# EAGLE design main_v2 (EAGLE 6.6.0)
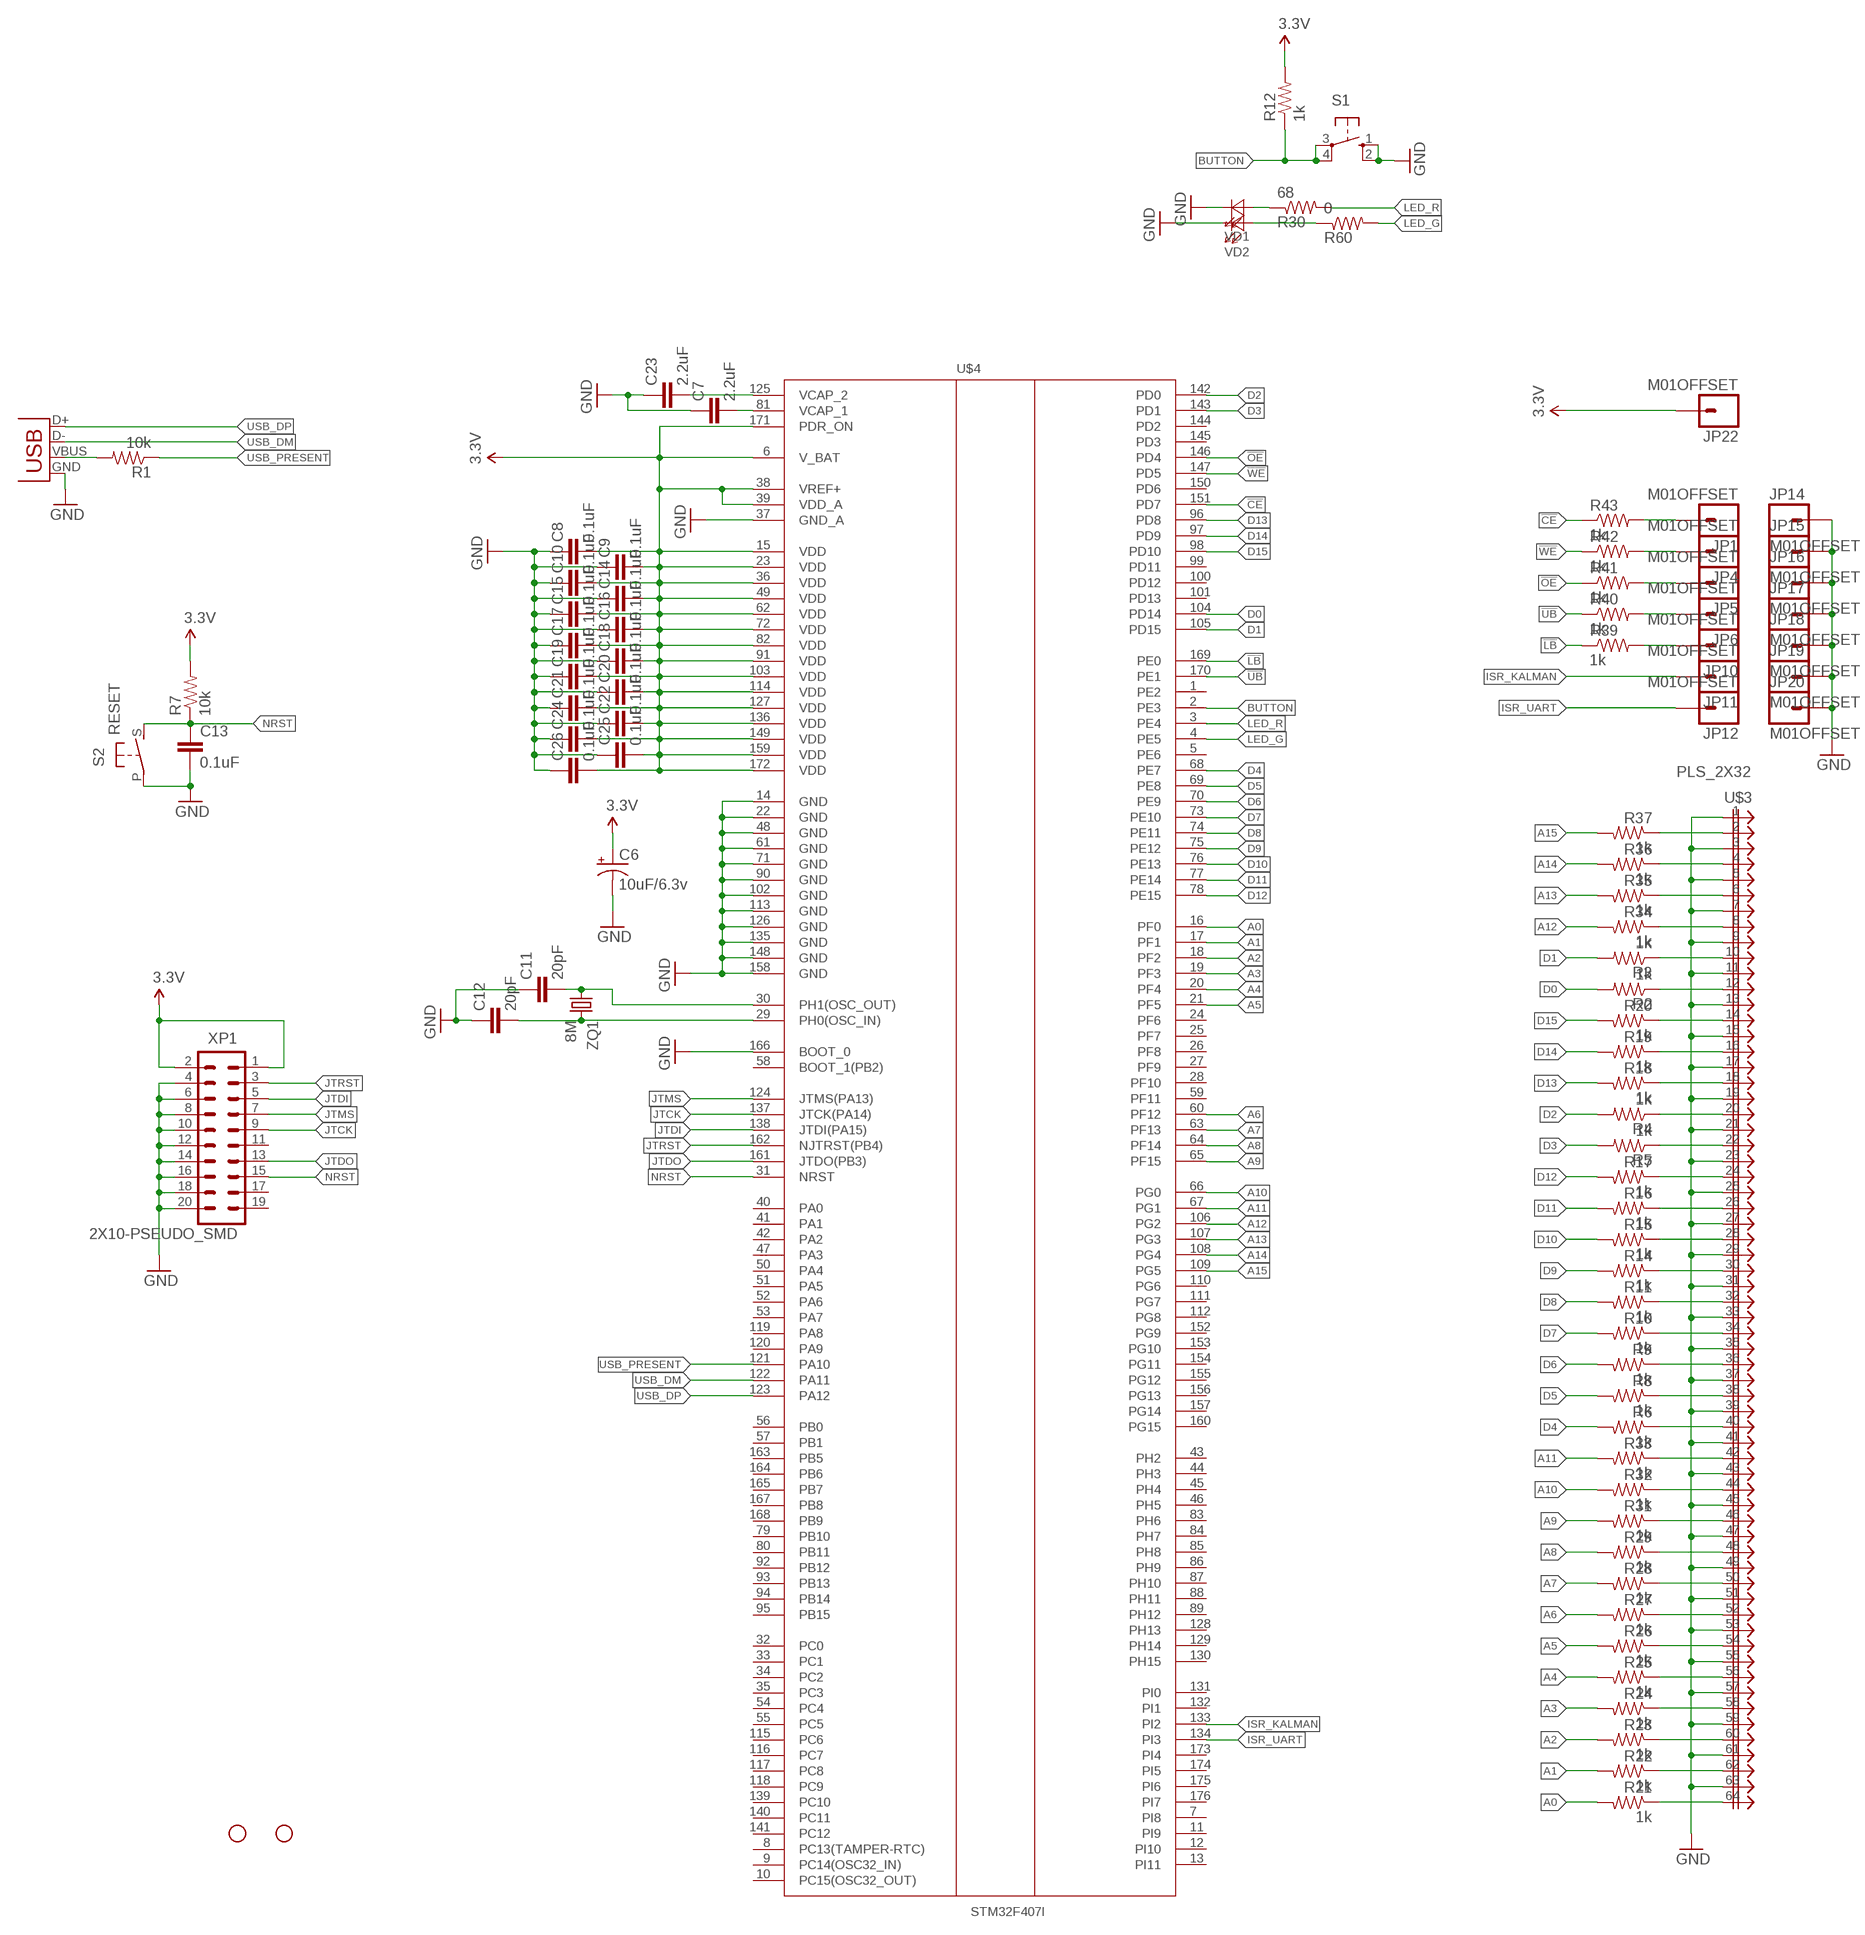
[diagram p0: schematic, sheet 1]

## Parts
C6  10uF/6.3v  CAP_POL1206-KIT  [EIA3216-KIT]
C7  2.2uF  CAP0805  [0805]
C8  0.1uF  CAP0805  [0805]
C9  0.1uF  CAP0805  [0805]
C10  0.1uF  CAP0805  [0805]
C11  20pF  CAP0805  [0805]
C12  20pF  CAP0805  [0805]
C13  0.1uF  CAP0805  [0805]
C14  0.1uF  CAP0805  [0805]
C15  0.1uF  CAP0805  [0805]
C16  0.1uF  CAP0805  [0805]
C17  0.1uF  CAP0805  [0805]
C18  0.1uF  CAP0805  [0805]
C19  0.1uF  CAP0805  [0805]
C20  0.1uF  CAP0805  [0805]
C21  0.1uF  CAP0805  [0805]
C22  0.1uF  CAP0805  [0805]
C23  2.2uF  CAP0805  [0805]
C24  0.1uF  CAP0805  [0805]
C25  0.1uF  CAP0805  [0805]
C26  0.1uF  CAP0805  [0805]
JP1  M01OFFSET  [1X01_OFFSET]
JP4  M01OFFSET  [1X01_OFFSET]
JP5  M01OFFSET  [1X01_OFFSET]
JP6  M01OFFSET  [1X01_OFFSET]
JP7  STAND-OFF  [STAND-OFF]
JP8  STAND-OFF  [STAND-OFF]
JP10  M01OFFSET  [1X01_OFFSET]
JP11  M01OFFSET  [1X01_OFFSET]
JP12  M01OFFSET  [1X01_OFFSET]
JP14  M01OFFSET  [1X01_OFFSET]
JP15  M01OFFSET  [1X01_OFFSET]
JP16  M01OFFSET  [1X01_OFFSET]
JP17  M01OFFSET  [1X01_OFFSET]
JP18  M01OFFSET  [1X01_OFFSET]
JP19  M01OFFSET  [1X01_OFFSET]
JP20  M01OFFSET  [1X01_OFFSET]
JP22  M01OFFSET  [1X01_OFFSET]
R1  10k  RESISTOR0805-RES  [0805]
R2  1k  RESISTOR0805-RES  [0805]
R3  1k  RESISTOR0805-RES  [0805]
R4  1k  RESISTOR0805-RES  [0805]
R5  1k  RESISTOR0805-RES  [0805]
R6  1k  RESISTOR0805-RES  [0805]
R7  10k  RESISTOR0805-RES  [0805]
R8  1k  RESISTOR0805-RES  [0805]
R9  1k  RESISTOR0805-RES  [0805]
R10  1k  RESISTOR0805-RES  [0805]
R11  1k  RESISTOR0805-RES  [0805]
R12  1k  RESISTOR0805-RES  [0805]
R14  1k  RESISTOR0805-RES  [0805]
R15  1k  RESISTOR0805-RES  [0805]
R16  1k  RESISTOR0805-RES  [0805]
R17  1k  RESISTOR0805-RES  [0805]
R18  1k  RESISTOR0805-RES  [0805]
R19  1k  RESISTOR0805-RES  [0805]
R20  1k  RESISTOR0805-RES  [0805]
R21  1k  RESISTOR0805-RES  [0805]
R22  1k  RESISTOR0805-RES  [0805]
R23  1k  RESISTOR0805-RES  [0805]
R24  1k  RESISTOR0805-RES  [0805]
R25  1k  RESISTOR0805-RES  [0805]
R26  1k  RESISTOR0805-RES  [0805]
R27  1k  RESISTOR0805-RES  [0805]
R28  1k  RESISTOR0805-RES  [0805]
R29  1k  RESISTOR0805-RES  [0805]
R30  68  RESISTOR0805-RES  [0805]
R31  1k  RESISTOR0805-RES  [0805]
R32  1k  RESISTOR0805-RES  [0805]
R33  1k  RESISTOR0805-RES  [0805]
R34  1k  RESISTOR0805-RES  [0805]
R35  1k  RESISTOR0805-RES  [0805]
R36  1k  RESISTOR0805-RES  [0805]
R37  1k  RESISTOR0805-RES  [0805]
R39  1k  RESISTOR0805-RES  [0805]
R40  1k  RESISTOR0805-RES  [0805]
R41  1k  RESISTOR0805-RES  [0805]
R42  1k  RESISTOR0805-RES  [0805]
R43  1k  RESISTOR0805-RES  [0805]
R60  0  RESISTOR0805-RES  [0805]
S1  10-XX  [B3F-10XX]
S2  RESET  BUTTON_6X3.5  [BUTTON_6X3.5]
U$3  PLS_2X32  [PLS_2X32_PSEUDOSMD]
U$4  STM32F407I  [TQFP176(1.5X0.25)]
VD1  LED1206  [LED-1206]
VD2  LED1206  [LED-1206]
X1  USB-SMD-NS  [USB-MINIB-NOSTOP]
XP1  2X10-PSEUDO_SMD  [PLD_2X10_PSEUDOSMD]
ZQ1  8M  CRYSTALCTS406  [CTS406]

## Nets
3.3V: C6.A(+) C8.2 C9.2 C10.2 C14.2 C15.2 C16.2 C17.2 C18.2 C19.2 C20.2 C21.2 C22.2 C24.2 C25.2 C26.2 JP22.1 R7.2 R12.2 U$4.6(V_BAT) U$4.15(VDD) U$4.23(VDD) U$4.36(VDD) U$4.38(VREF+) U$4.39(VDD_A) U$4.49(VDD) U$4.62(VDD) U$4.72(VDD) U$4.82(VDD) U$4.91(VDD) U$4.103(VDD) U$4.114(VDD) U$4.127(VDD) U$4.136(VDD) U$4.149(VDD) U$4.159(VDD) U$4.171(PDR_ON) U$4.172(VDD) XP1.1 XP1.2
5V_USB: R1.2 X1.VBUS
!CE: R43.1 U$4.151(PD7)
!LB: R39.1 U$4.169(PE0)
!OE: R41.1 U$4.146(PD4)
!UB: R40.1 U$4.170(PE1)
!WE: R42.1 U$4.147(PD5)
A0: R21.2 U$4.16(PF0)
A1: R22.2 U$4.17(PF1)
A2: R23.2 U$4.18(PF2)
A3: R24.2 U$4.19(PF3)
A4: R25.2 U$4.20(PF4)
A5: R26.2 U$4.21(PF5)
A6: R27.2 U$4.60(PF12)
A7: R28.2 U$4.63(PF13)
A8: R29.2 U$4.64(PF14)
A9: R31.2 U$4.65(PF15)
A10: R32.2 U$4.66(PG0)
A11: R33.2 U$4.67(PG1)
A12: R34.2 U$4.106(PG2)
A13: R35.2 U$4.107(PG3)
A14: R36.2 U$4.108(PG4)
A15: R37.2 U$4.109(PG5)
BUTTON: R12.1 S1.3(P) S1.4(P1) U$4.2(PE3)
D0: R2.2 U$4.104(PD14)
D1: R3.2 U$4.105(PD15)
D2: R4.2 U$4.142(PD0)
D3: R5.2 U$4.143(PD1)
D4: R6.2 U$4.68(PE7)
D5: R8.2 U$4.69(PE8)
D6: R9.2 U$4.70(PE9)
D7: R10.2 U$4.73(PE10)
D8: R11.2 U$4.74(PE11)
D9: R14.2 U$4.75(PE12)
D10: R15.2 U$4.76(PE13)
D11: R16.2 U$4.77(PE14)
D12: R17.2 U$4.78(PE15)
D13: R18.2 U$4.96(PD8)
D14: R19.2 U$4.97(PD9)
D15: R20.2 U$4.98(PD10)
GND: C6.C(-) C7.1 C8.1 C9.1 C10.1 C11.1 C12.1 C13.2 C14.1 C15.1 C16.1 C17.1 C18.1 C19.1 C20.1 C21.1 C22.1 C23.1 C24.1 C25.1 C26.1 JP14.1 JP15.1 JP16.1 JP17.1 JP18.1 JP19.1 JP20.1 S1.1(S) S1.2(S1) S2.P U$3.1 U$3.3 U$3.5 U$3.7 U$3.9 U$3.11 U$3.13 U$3.15 U$3.17 U$3.19 U$3.21 U$3.23 U$3.25 U$3.27 U$3.29 U$3.31 U$3.33 U$3.35 U$3.37 U$3.39 U$3.41 U$3.43 U$3.45 U$3.47 U$3.49 U$3.51 U$3.53 U$3.55 U$3.57 U$3.59 U$3.61 U$3.63 U$4.14(GND) U$4.22(GND) U$4.37(GND_A) U$4.48(GND) U$4.61(GND) U$4.71(GND) U$4.90(GND) U$4.102(GND) U$4.113(GND) U$4.126(GND) U$4.135(GND) U$4.148(GND) U$4.158(GND) U$4.166(BOOT_0) VD1.C VD2.C X1.GND XP1.4 XP1.6 XP1.8 XP1.10 XP1.12 XP1.14 XP1.16 XP1.18 XP1.20
ISR_KALMAN: JP11.1 U$4.133(PI2)
ISR_UART: JP12.1 U$4.134(PI3)
JTCK: U$4.137(JTCK(PA14)) XP1.9
JTDI: U$4.138(JTDI(PA15)) XP1.5
JTDO: U$4.161(JTDO(PB3)) XP1.13
JTMS: U$4.124(JTMS(PA13)) XP1.7
JTRST: U$4.162(NJTRST(PB4)) XP1.3
LED_G: R60.2 U$4.4(PE5)
LED_R: R30.2 U$4.3(PE4)
N$1: C23.2 U$4.125(VCAP_2)
N$2: C7.2 U$4.81(VCAP_1)
N$3: JP1.1 R43.2
N$4: R5.1 U$3.22
N$5: R4.1 U$3.20
N$6: R18.1 U$3.18
N$7: R19.1 U$3.16
N$8: R6.1 U$3.40
N$9: R8.1 U$3.38
N$10: R21.1 U$3.64
N$11: R9.1 U$3.36
N$12: R30.1 VD1.A
N$13: R22.1 U$3.62
N$14: R10.1 U$3.34
N$15: R11.1 U$3.32
N$16: R14.1 U$3.30
N$17: R15.1 U$3.28
N$18: R16.1 U$3.26
N$19: R17.1 U$3.24
N$20: R20.1 U$3.14
N$21: C12.2 U$4.29(PH0(OSC_IN)) ZQ1.3
N$22: C11.2 U$4.30(PH1(OSC_OUT)) ZQ1.1
N$23: R2.1 U$3.12
N$24: R3.1 U$3.10
N$25: R23.1 U$3.60
N$26: R24.1 U$3.58
N$27: R25.1 U$3.56
N$28: R26.1 U$3.54
N$29: R27.1 U$3.52
N$30: R28.1 U$3.50
N$31: R60.1 VD2.A
N$32: R29.1 U$3.48
N$33: R31.1 U$3.46
N$34: R32.1 U$3.44
N$35: R33.1 U$3.42
N$36: R34.1 U$3.8
N$37: R35.1 U$3.6
N$38: R36.1 U$3.4
N$39: R37.1 U$3.2
N$42: JP4.1 R42.2
N$43: JP5.1 R41.2
N$44: JP6.1 R40.2
N$45: JP10.1 R39.2
NRST: C13.1 R7.1 S2.S U$4.31(NRST) XP1.15
USB_DM: U$4.122(PA11) X1.D-
USB_DP: U$4.123(PA12) X1.D+
USB_PRESENT: R1.1 U$4.121(PA10)
Unconnected: U$4.1(PE2) U$4.5(PE6) U$4.7(PI8) U$4.8(PC13(TAMPER-RTC)) U$4.9(PC14(OSC32_IN)) U$4.10(PC15(OSC32_OUT)) U$4.11(PI9) U$4.12(PI10) U$4.13(PI11) U$4.24(PF6) U$4.25(PF7) U$4.26(PF8) U$4.27(PF9) U$4.28(PF10) U$4.32(PC0) U$4.33(PC1) U$4.34(PC2) U$4.35(PC3) U$4.40(PA0) U$4.41(PA1) U$4.42(PA2) U$4.43(PH2) U$4.44(PH3) U$4.45(PH4) U$4.46(PH5) U$4.47(PA3) U$4.50(PA4) U$4.51(PA5) U$4.52(PA6) U$4.53(PA7) U$4.54(PC4) U$4.55(PC5) U$4.56(PB0) U$4.57(PB1) U$4.58(BOOT_1(PB2)) U$4.59(PF11) U$4.79(PB10) U$4.80(PB11) U$4.83(PH6) U$4.84(PH7) U$4.85(PH8) U$4.86(PH9) U$4.87(PH10) U$4.88(PH11) U$4.89(PH12) U$4.92(PB12) U$4.93(PB13) U$4.94(PB14) U$4.95(PB15) U$4.99(PD11) U$4.100(PD12) U$4.101(PD13) U$4.110(PG6) U$4.111(PG7) U$4.112(PG8) U$4.115(PC6) U$4.116(PC7) U$4.117(PC8) U$4.118(PC9) U$4.119(PA8) U$4.120(PA9) U$4.128(PH13) U$4.129(PH14) U$4.130(PH15) U$4.131(PI0) U$4.132(PI1) U$4.139(PC10) U$4.140(PC11) U$4.141(PC12) U$4.144(PD2) U$4.145(PD3) U$4.150(PD6) U$4.152(PG9) U$4.153(PG10) U$4.154(PG11) U$4.155(PG12) U$4.156(PG13) U$4.157(PG14) U$4.160(PG15) U$4.163(PB5) U$4.164(PB6) U$4.165(PB7) U$4.167(PB8) U$4.168(PB9) U$4.173(PI4) U$4.174(PI5) U$4.175(PI6) U$4.176(PI7) XP1.11 XP1.17 XP1.19

## Library data of the parts
C6 = SparkFun:CAP_POL: Capacitor Polarized These are standard SMD and PTH capacitors. Normally 10uF, 47uF, and 100uF in electrolytic and tantalum varieties. Always verify the external diameter of the through hole cap, it varies with capacity, voltage, and manufacturer. The EIA devices should be standard.
C7-C26 = SparkFun:CAP: Capacitor Standard 0603 ceramic capacitor, and 0.1" leaded capacitor.
JP1 JP4-JP6 JP10-JP12 JP14-JP20 JP22 = SparkFun-Connectors:M01: Header 1 Standard 1-pin 0.1" header. Use with straight break away headers (SKU : PRT-00116), right angle break away headers (PRT-00553), swiss pins (PRT-00743), machine pins (PRT-00117), and female headers (PRT-00115).
JP7 JP8 = barthess:STAND-OFF: Stand Off This is the mechanical footprint for a #4 phillips button head screw. Use the keepout ring to avoid running the screw head into surrounding components. SKU : PRT-00447
R1-R12 R14-R37 R39-R43 R60 = SparkFun:RESISTOR: Resistor Basic schematic elements and footprints for 0603, 1206, and PTH resistors.
S1 = switch-omron:10-XX: OMRON SWITCH; MPN: B3F-1000; OC_FARNELL: 176432; OC_NEWARK: 36M3542
S2 = barthess:BUTTON_6X3.5: OMRON SWITCH
U$3 = barthess:PLS_2X32
U$4 = barthess:STM32F407I
VD1 VD2 = led:LED: LEDs SMD Leds
X1 = SparkFun:USB: USB Connectors USB-B-PTH is fully proven SKU : PRT-00139 USB-miniB is fully proven SKU : PRT-00587 USB-A-PCB is untested. USB-A-H is throughly reviewed, but untested. Spark Fun Electronics SKU : PRT-00437 USB-B-SMT is throughly reviewed, but untested. Needs silkscreen touching up. USB-A-S has not been used/tested USB-MB-H has not been used/tested
XP1 = barthess:2X10: Standard 10x2 JTAG header for ARM.
ZQ1 = crystal:CRYSTAL: CRYSTAL; OC_FARNELL: unknown; OC_NEWARK: unknown

## Net classes
1 +5V_A: width 0.4 mm, drill 0.5 mm
2 +3.3V_A: width 0.4 mm, drill 0.5 mm
3 GND_A: width 0.4 mm, drill 0.5 mm

## Board
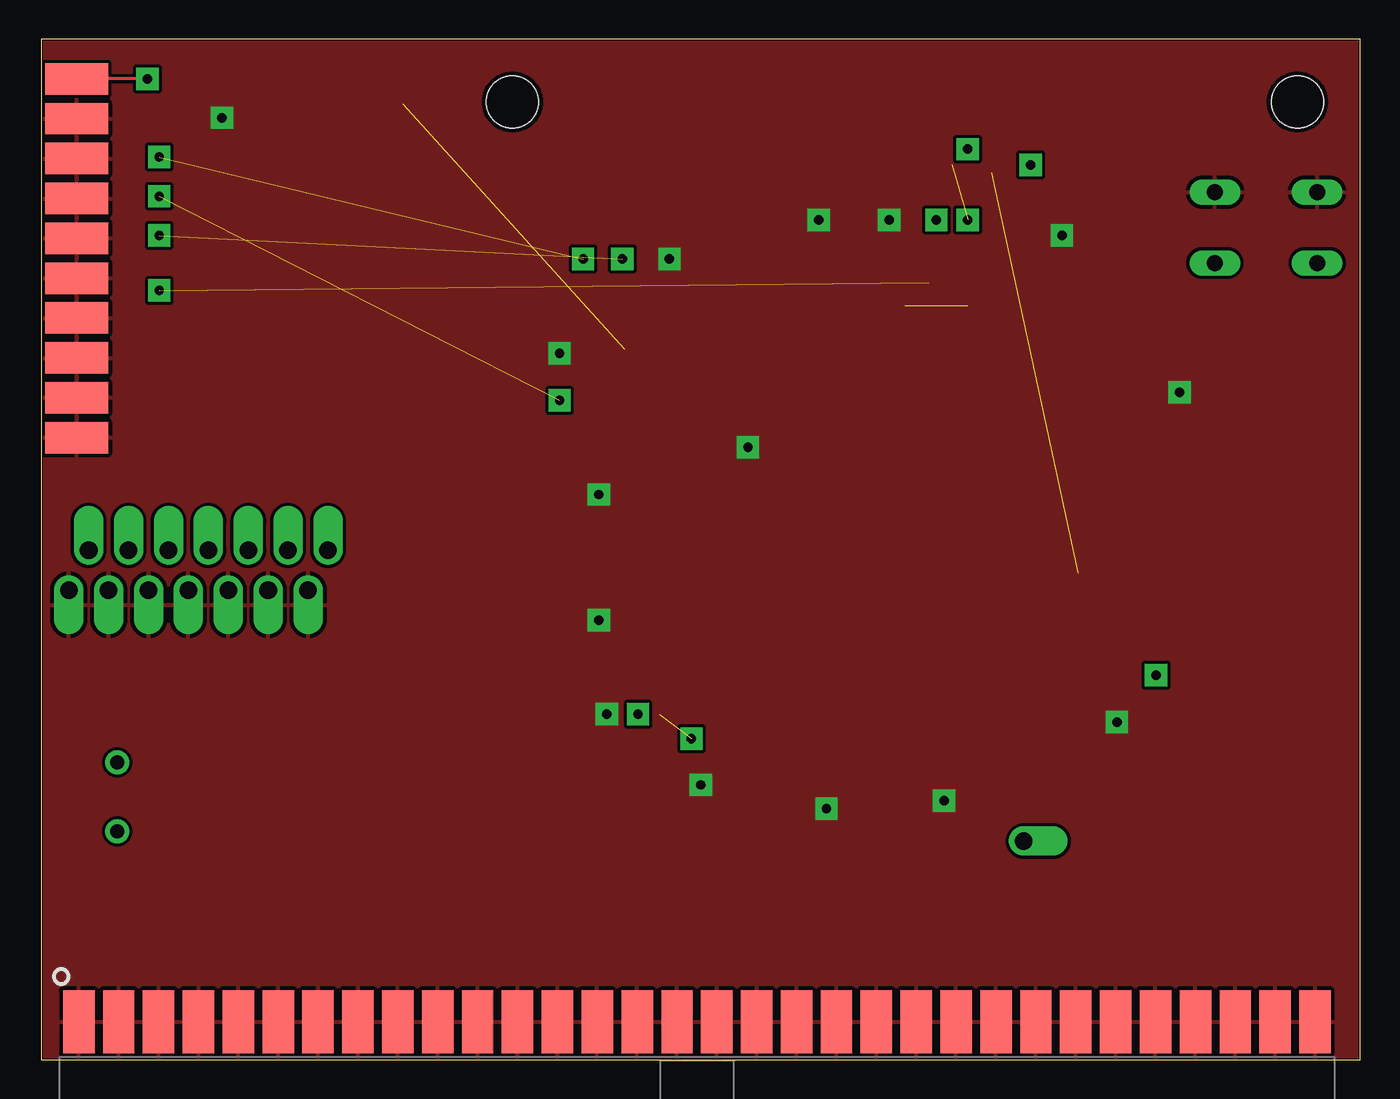
[diagram p1: board, top side]
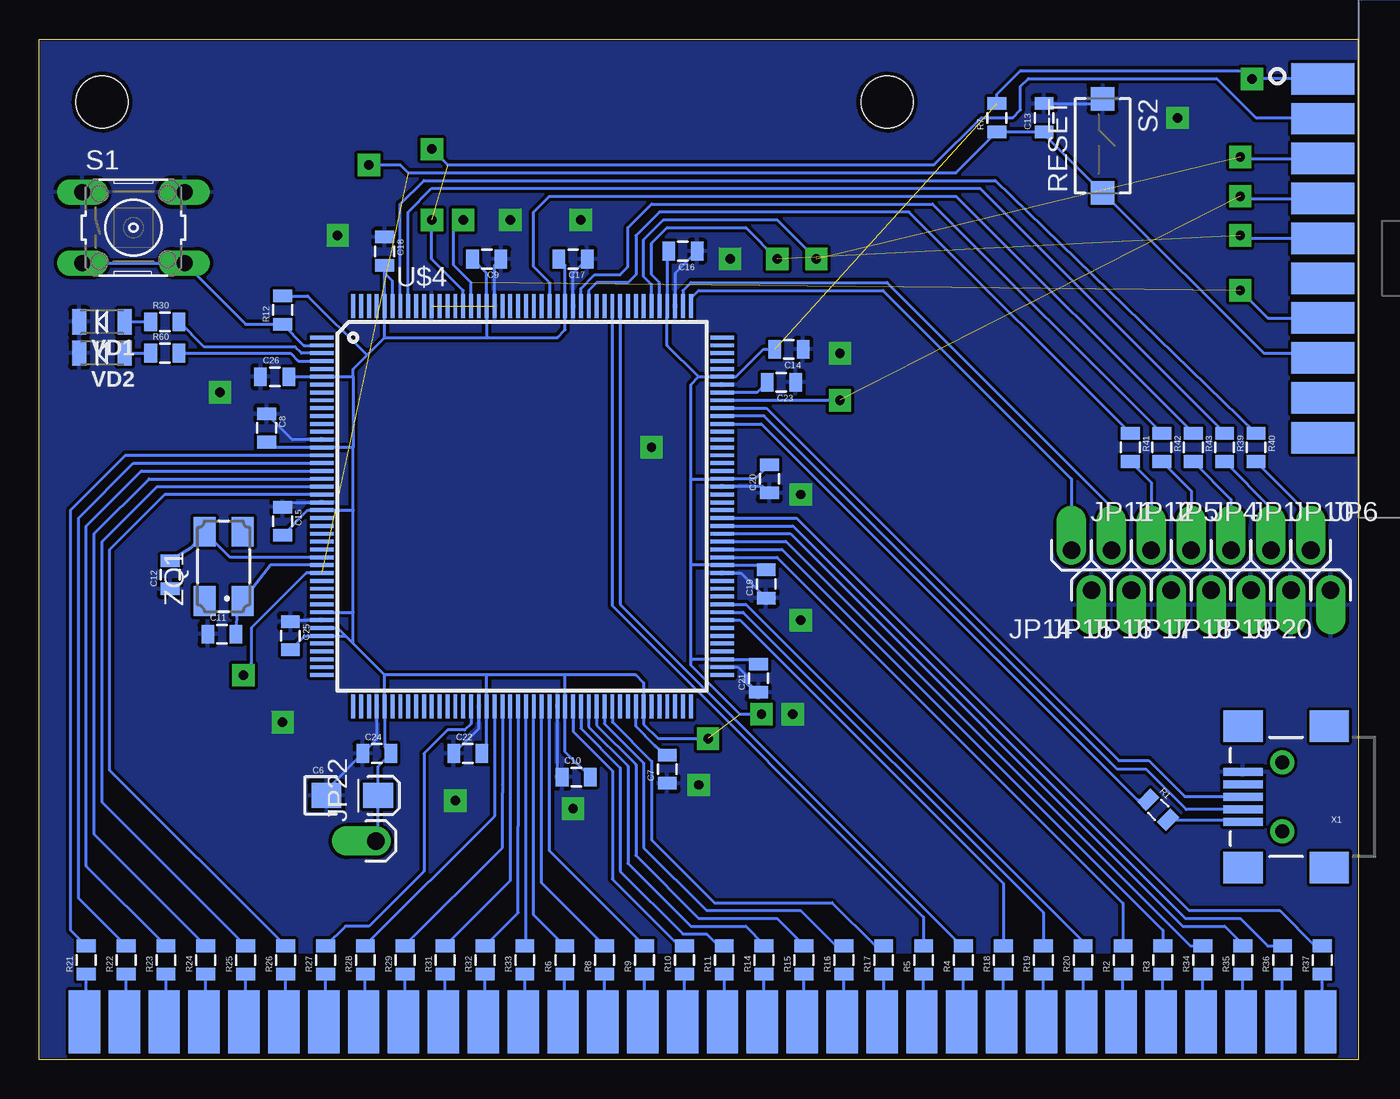
[diagram p2: board, bottom side, seen from below]

Size 84 x 65 mm. Coordinates in mm from the lower left corner, seen from the top.
Outline: 0,0 84,0 84,65 0,65 0,0
Copper layers (1*16): Top 0.035mm / dielectric 1.5mm / Bottom 0.035mm
Design rules "lut": minimum track width 0.0051mm, minimum drill 0.3mm, track to track 0.2mm, track to pad 0.25mm, pad to pad 0.15mm, via to via 0.15mm, smd to smd 0.15mm, copper to edge 0.1mm, drill to drill 40mil, minimum pad ring 12mil, minimum via ring 12mil, stop-mask expansion 4mil, vias tented up to drill 0mil, thermal gap 10mil
bRestrict: area 1.5,6 to 81.8,6.8

### Footprints (pad centres in the part's own frame; a part is rotated, then mirrored left to right if it is on the bottom)
EIA3216-KIT = smd 1.9 x 1.6: A 1.65,0; C -1.65,0
0805 = smd 0.8 x 1.2: 1 -0.9,0; 2 0.9,0
1X01_OFFSET = drill 1.118 pad 1.88 offset: 1 0,0
STAND-OFF = hole 3.3: 0,0
B3F-10XX = drill 1.016 long: 1 -3.251,2.261; 2 3.251,2.261; 3 -3.251,-2.261; 4 3.251,-2.261
BUTTON_6X3.5 = smd 1.5 x 1.5: P 0,-1.75; S 6,-1.75
PLS_2X32_PSEUDOSMD = smd 4 x 2: 1 -3.81,-39.37; 3 -3.81,-36.83; 5 -3.81,-34.29; 7 -3.81,-31.75; 9 -3.81,-29.21; 11 -3.81,-26.67; 13 -3.81,-24.13; 15 -3.81,-21.59; 17 -3.81,-19.05; 19 -3.81,-16.51; 21 -3.81,-13.97; 23 -3.81,-11.43; 25 -3.81,-8.89; 27 -3.81,-6.35; 29 -3.81,-3.81; 31 -3.81,-1.27; 33 -3.81,1.27; 35 -3.81,3.81; 37 -3.81,6.35; 39 -3.81,8.89; 41 -3.81,11.43; 43 -3.81,13.97; 45 -3.81,16.51; 47 -3.81,19.05; 49 -3.81,21.59; 51 -3.81,24.13; 53 -3.81,26.67; 55 -3.81,29.21; 57 -3.81,31.75; 59 -3.81,34.29; 61 -3.81,36.83; 63 -3.81,39.37 | smd 4 x 2 bottom: 2 -3.81,-39.37; 4 -3.81,-36.83; 6 -3.81,-34.29; 8 -3.81,-31.75; 10 -3.81,-29.21; 12 -3.81,-26.67; 14 -3.81,-24.13; 16 -3.81,-21.59; 18 -3.81,-19.05; 20 -3.81,-16.51; 22 -3.81,-13.97; 24 -3.81,-11.43; 26 -3.81,-8.89; 28 -3.81,-6.35; 30 -3.81,-3.81; 32 -3.81,-1.27; 34 -3.81,1.27; 36 -3.81,3.81; 38 -3.81,6.35; 40 -3.81,8.89; 42 -3.81,11.43; 44 -3.81,13.97; 46 -3.81,16.51; 48 -3.81,19.05; 50 -3.81,21.59; 52 -3.81,24.13; 54 -3.81,26.67; 56 -3.81,29.21; 58 -3.81,31.75; 60 -3.81,34.29; 62 -3.81,36.83; 64 -3.81,39.37
TQFP176(1.5X0.25) = smd 1.5 x 0.25: 1 -12,10; 2 -12,9.5; 3 -12,9; 4 -12,8.5; 5 -12,8; 6 -12,7.5; 7 -12,7; 8 -12,6.5; 9 -12,6; 10 -12,5.5; 11 -12,5; 12 -12,4.5; 13 -12,4; 14 -12,3.5; 15 -12,3; 16 -12,2.5; 17 -12,2; 18 -12,1.5; 19 -12,1; 20 -12,0.5; 21 -12,0; 22 -12,-0.5; 23 -12,-1; 24 -12,-1.5; 25 -12,-2; 26 -12,-2.5; 27 -12,-3; 28 -12,-3.5; 29 -12,-4; 30 -12,-4.5; 31 -12,-5; 32 -12,-5.5; 33 -12,-6; 34 -12,-6.5; 35 -12,-7; 36 -12,-7.5; 37 -12,-8; 38 -12,-8.5; 39 -12,-9; 40 -12,-9.5; 41 -12,-10; 42 -12,-10.5; 43 -12,-11; 44 -12,-11.5; 89 13.5,-11.5; 90 13.5,-11; 91 13.5,-10.5; 92 13.5,-10; 93 13.5,-9.5; 94 13.5,-9; 95 13.5,-8.5; 96 13.5,-8; 97 13.5,-7.5; 98 13.5,-7; 99 13.5,-6.5; 100 13.5,-6; 101 13.5,-5.5; 102 13.5,-5; 103 13.5,-4.5; 104 13.5,-4; 105 13.5,-3.5; 106 13.5,-3; 107 13.5,-2.5; 108 13.5,-2; 109 13.5,-1.5; 110 13.5,-1; 111 13.5,-0.5; 112 13.5,0; 113 13.5,0.5; 114 13.5,1; 115 13.5,1.5; 116 13.5,2; 117 13.5,2.5; 118 13.5,3; 119 13.5,3.5; 120 13.5,4; 121 13.5,4.5; 122 13.5,5; 123 13.5,5.5; 124 13.5,6; 125 13.5,6.5; 126 13.5,7; 127 13.5,7.5; 128 13.5,8; 129 13.5,8.5; 130 13.5,9; 131 13.5,9.5; 132 13.5,10 | smd 0.25 x 1.5: 45 -10,-13.5; 46 -9.5,-13.5; 47 -9,-13.5; 48 -8.5,-13.5; 49 -8,-13.5; 50 -7.5,-13.5; 51 -7,-13.5; 52 -6.5,-13.5; 53 -6,-13.5; 54 -5.5,-13.5; 55 -5,-13.5; 56 -4.5,-13.5; 57 -4,-13.5; 58 -3.5,-13.5; 59 -3,-13.5; 60 -2.5,-13.5; 61 -2,-13.5; 62 -1.5,-13.5; 63 -1,-13.5; 64 -0.5,-13.5; 65 0,-13.5; 66 0.5,-13.5; 67 1,-13.5; 68 1.5,-13.5; 69 2,-13.5; 70 2.5,-13.5; 71 3,-13.5; 72 3.5,-13.5; 73 4,-13.5; 74 4.5,-13.5; 75 5,-13.5; 76 5.5,-13.5; 77 6,-13.5; 78 6.5,-13.5; 79 7,-13.5; 80 7.5,-13.5; 81 8,-13.5; 82 8.5,-13.5; 83 9,-13.5; 84 9.5,-13.5; 85 10,-13.5; 86 10.5,-13.5; 87 11,-13.5; 88 11.5,-13.5; 133 11.5,12; 134 11,12; 135 10.5,12; 136 10,12; 137 9.5,12; 138 9,12; 139 8.5,12; 140 8,12; 141 7.5,12; 142 7,12; 143 6.5,12; 144 6,12; 145 5.5,12; 146 5,12; 147 4.5,12; 148 4,12; 149 3.5,12; 150 3,12; 151 2.5,12; 152 2,12; 153 1.5,12; 154 1,12; 155 0.5,12; 156 0,12; 157 -0.5,12; 158 -1,12; 159 -1.5,12; 160 -2,12; 161 -2.5,12; 162 -3,12; 163 -3.5,12; 164 -4,12; 165 -4.5,12; 166 -5,12; 167 -5.5,12; 168 -6,12; 169 -6.5,12; 170 -7,12; 171 -7.5,12; 172 -8,12; 173 -8.5,12; 174 -9,12; 175 -9.5,12; 176 -10,12
LED-1206 = smd 0.9 x 1.6: A -1.45,0; C 1.45,0
USB-MINIB-NOSTOP = smd 2.5 x 0.5: D+ 2.5,0; D- 2.5,0.8; GND 2.5,-1.6; ID 2.5,-0.8; VBUS 2.5,1.6 | smd 2.5 x 2: G1 -3,-4.5; G2 -3,4.5; G3 2.5,4.5; G4 2.5,-4.5 | drill 0.9 pad 0.8: H1 0,2.2 | drill 0.9 pad 0.787: H2 0,-2.2
PLD_2X10_PSEUDOSMD = smd 4 x 2: 1 0,11.43; 3 0,8.89; 5 0,6.35; 7 0,3.81; 9 0,1.27; 11 0,-1.27; 13 0,-3.81; 15 0,-6.35; 17 0,-8.89; 19 0,-11.43 | smd 4 x 2 bottom: 2 0,11.43; 4 0,8.89; 6 0,6.35; 8 0,3.81; 10 0,1.27; 12 0,-1.27; 14 0,-3.81; 16 0,-6.35; 18 0,-8.89; 20 0,-11.43
CTS406 = smd 1.9 x 1.4: 1 -2.2,-1.2; 2 2.2,-1.2; 3 2.2,1.2; 4 -2.2,1.2

### Placement (x,y rotation side)
C6  64.06,16.83 0 bottom
C7  44,18.5 90 bottom
C8  69.52,40.24 270 bottom
C9  55.5,51 180 bottom
C10  49.8,18 0 bottom
C11  72.36,27.11 0 bottom
C12  75.66,30.89 90 bottom
C13  20,60 90 bottom
C14  36.25,45.25 180 bottom
C15  68.5,34.3 270 bottom
C16  43,51.5 180 bottom
C17  50,51 180 bottom
C18  62,51.5 270 bottom
C19  37.7,30.3 90 bottom
C20  37.5,37 90 bottom
C21  38.2,24.3 90 bottom
C22  56.7,19.5 0 bottom
C23  36.73,43.15 180 bottom
C24  62.5,19.5 0 bottom
C25  68,27 270 bottom
C26  69,43.5 0 bottom
JP1  8.09,32.45 0 bottom
JP4  10.63,32.45 0 bottom
JP5  13.17,32.45 0 bottom
JP6  3.01,32.45 0 bottom
JP7  30,61 0 top
JP8  80,61 0 top
JP10  5.55,32.45 0 bottom
JP11  18.25,32.45 0 bottom
JP12  15.71,32.45 0 bottom
JP14  16.98,29.91 180 bottom
JP15  14.44,29.91 180 bottom
JP16  11.9,29.91 180 bottom
JP17  9.36,29.91 180 bottom
JP18  6.82,29.91 180 bottom
JP19  4.28,29.91 180 bottom
JP20  1.74,29.91 180 bottom
JP22  62.55,13.93 90 bottom
R1  12.73,15.92 315 bottom
R2  14.97,6.35 90 bottom
R3  12.43,6.35 90 bottom
R4  25.13,6.35 90 bottom
R5  27.67,6.35 90 bottom
R6  50.53,6.35 90 bottom
R7  23,60 90 bottom
R8  47.99,6.35 90 bottom
R9  45.45,6.35 90 bottom
R10  42.91,6.35 90 bottom
R11  40.37,6.35 90 bottom
R12  68.5,47.75 90 bottom
R14  37.83,6.35 90 bottom
R15  35.29,6.35 90 bottom
R16  32.75,6.35 90 bottom
R17  30.21,6.35 90 bottom
R18  22.59,6.35 90 bottom
R19  20.05,6.35 90 bottom
R20  17.51,6.35 90 bottom
R21  81.01,6.35 90 bottom
R22  78.47,6.35 90 bottom
R23  75.93,6.35 90 bottom
R24  73.39,6.35 90 bottom
R25  70.85,6.35 90 bottom
R26  68.31,6.35 90 bottom
R27  65.77,6.35 90 bottom
R28  63.23,6.35 90 bottom
R29  60.69,6.35 90 bottom
R30  76,47 0 bottom
R31  58.15,6.35 90 bottom
R32  55.61,6.35 90 bottom
R33  53.07,6.35 90 bottom
R34  9.89,6.35 90 bottom
R35  7.35,6.35 90 bottom
R36  4.81,6.35 90 bottom
R37  2.27,6.35 90 bottom
R39  8.5,39 270 bottom
R40  6.5,39 270 bottom
R41  14.5,39 270 bottom
R42  12.5,39 270 bottom
R43  10.5,39 270 bottom
R60  76,45 0 bottom
S1  78,53 0 bottom
S2  14.52,61.21 270 bottom
U$3  41.75,-1.4 270 top
U$4  54,36 0 bottom
VD1  80,47 180 bottom
VD2  80,45 180 bottom
X1  4.83,16.74 180 bottom
XP1  2.25,51.05 0 bottom
ZQ1  72.25,31.43 90 bottom

### Tracks (layer width: path | path; a pad name or v marks a point on that pad's centre or on a via)
3.3V  (via drill 0.6 pad 1.42)  (2 unrouted)
  Top 0.2: 2.27,62.5 XP1.2 v6.75,62.48
  Bottom 0.2: C25.2 67.1,27 U$4.39 64.5,27 | C15.2 66.9,35 U$4.23 64,35 | C22.2 55.5,19.8 U$4.62 55.5,24.5 | C10.2 50.5,19.6 U$4.72 50.5,24.5 | C19.2 38,31.5 U$4.103 42.5,31.5 | C21.2 38.6,25.5 U$4.91 42.5,25.5 | C20.2 38.4,37 U$4.114 42.5,37 | C17.2 50.5,50.6 U$4.149 50.5,46.5 51,46 55.5,46 | C9.2 55.5,50.1 U$4.159 55.5,46 | 62,50.1 U$4.172 62,46 | 62,50.1 C18.2 | U$4.171 61.5,49.6 62,50.1 | C26.2 U$4.6 64,43.5 | C16.2 44,51.4 U$4.136 44,45.5 42,43.5 | 62,24.5 U$4.49 62,19.9 C24.2 62.41,18.69 C6.A 62.41,14.07 JP22.1 | 62,24.5 64,26.5 | 64,26.5 64.5,27 | U$4.36 64,28.5 | 64,28.5 64,35 | U$4.38 65,27.5 64.5,27 | 55.5,24.5 62,24.5 | 50.5,24.5 46,24.5 45.5,24 U$4.82 45.5,21.37 44.59,20.45 v41.4,20.45 | 50.5,24.5 55.5,24.5 | v38,22 39.38,22 42.5,25.12 42.5,25.5 | 42.5,25.5 42.5,31.5 | 42.5,31.5 42.5,37 | 42.5,37 42.5,43 42,43.5 | 42,43.5 U$4.127 39.62,43.5 37.88,45.25 C14.2 | 64,26.5 64,28.5 | 64,35 64,39 | 64,39 U$4.15 69.18,39 C8.2 | 64,43.5 64,39 | 64,43.5 64,44 63.12,44.88 | 63.12,44.88 62,46 | 62,46 55.5,46 | R7.2 23,61.5 21.5,63 7.27,63 v6.75,62.48 XP1.2 | R12.2 66.9,48.65 63.12,44.88
5V_USB
  Bottom 0.2: R1.2 7.47,15.28 X1.VBUS
!CE
  Bottom 0.2: R43.1 25.6,55 51.5,55 52.5,54 52.5,50.5 51.5,49.5 U$4.151
!LB
  Bottom 0.2: R39.1 24.1,55.5 59,55.5 60.5,54 U$4.169
!OE
  Bottom 0.2: R41.1 28.6,54 44.5,54 46,52.5 46,50 46.5,49.5 48.5,49.5 49,49 U$4.146
!UB
  Bottom 0.2: R40.1 23.1,56 59.5,56 61,54.5 U$4.170
!WE
  Bottom 0.2: R42.1 27.1,54.5 45,54.5 46.5,53 46.5,50.5 47,50 48.62,50 49.5,49.12 U$4.147
A0
  Bottom 0.2: R21.2 82,8.24 82,35 78.5,38.5 U$4.16
A1
  Bottom 0.2: R22.2 81.5,10.28 81.5,34.5 78,38 U$4.17
A2
  Bottom 0.2: R23.2 81,12.32 81,34 77.5,37.5 U$4.18
A3
  Bottom 0.2: R24.2 80.5,14.36 80.5,33.5 77,37 U$4.19
A4
  Bottom 0.2: R25.2 80,16.4 80,33 76.5,36.5 U$4.20
A5
  Bottom 0.2: U$4.21 76,36 79.5,32.5 79.5,18.44 R26.2
A6
  Bottom 0.2: U$4.60 56.5,21.4 56.9,21 58,21 59.5,19.5 59.5,12 63,8.5 64.5,8.5 65.75,7.25 R27.2
A7
  Bottom 0.2: U$4.63 55,15.5 63.23,7.27 R28.2
A8
  Bottom 0.2: U$4.64 54.5,17.5 54.5,17 54.5,13.5 60.69,7.31 R29.2
A9
  Bottom 0.2: U$4.65 54,11.4 R31.2
A10
  Bottom 0.2: U$4.66 53.5,15 53.5,14.86 53.5,9.36 R32.2
A11
  Bottom 0.2: R33.2 53,7.32 U$4.67
A12
  Bottom 0.2: U$4.106 40.48,33.02 36.45,33.02 10.68,7.25 R34.2
A13
  Bottom 0.2: U$4.107 36.17,33.5 11.17,8.5 8.5,8.5 7.35,7.35 R35.2
A14
  Bottom 0.2: U$4.108 36,34 11,9 7.5,9 5.75,7.25 R36.2
A15
  Bottom 0.2: U$4.109 35.77,34.5 10.77,9.5 5,9.5 2.75,7.25 R37.2
BUTTON
  Bottom 0.2: S1.3 S1.4 70.86,46.85 R12.1 67.15,45.5 U$4.2
D0
  Bottom 0.2: U$4.104 37,32 14.97,9.97 R2.2
D1
  Bottom 0.2: U$4.105 40.49,32.51 36.7,32.51 12.43,8.24 R3.2
D2
  Bottom 0.2: U$4.142 47,29 25.25,7.25 R4.2
D3
  Bottom 0.2: U$4.143 47.5,28.9 27.67,9.07 R5.2
D4
  Bottom 0.2: R6.2 52.5,9.22 U$4.68
D5
  Bottom 0.2: R8.2 52,11.26 U$4.69
D6
  Bottom 0.2: R9.2 51.5,13.3 U$4.70
D7
  Bottom 0.2: U$4.73 50,20.9 47.5,18.4 47.5,11.5 43.25,7.25 R10.2
D8
  Bottom 0.2: U$4.74 49.5,21.1 47,18.6 47,12 43,8 41.5,8 40.75,7.25 R11.2
D9
  Bottom 0.2: U$4.75 49,21.2 46.5,18.7 46.5,12.5 42.5,8.5 39,8.5 37.83,7.33 R14.2
D10
  Bottom 0.2: U$4.76 48.5,21.3 46,18.8 46,13 42,9 37,9 35.29,7.29 R15.2
D11
  Bottom 0.2: U$4.77 48,21.4 45.5,18.9 45.5,13.5 41.5,9.5 35.5,9.5 33.25,7.25 R16.2
D12
  Bottom 0.2: U$4.78 47.5,21.5 45,19 45,14 41,10 33.5,10 30.75,7.25 R17.2
D13
  Bottom 0.2: U$4.96 39.37,28 22.59,11.22 R18.2
D14
  Bottom 0.2: U$4.97 39.17,28.5 20.05,9.38 R19.2
D15
  Bottom 0.2: U$4.98 39,29 17.51,7.51 R20.2
GND  (via drill 0.6 pad 1.42)  (1 unrouted)
  Bottom 0.2: C25.1 67.9,28 U$4.37 | C15.1 68.5,35.5 U$4.22 | C22.1 56,21.1 U$4.61 | C10.1 51,18.3 U$4.71 | U$4.102 39.3,31 C19.1 | C20.1 37.9,36.5 U$4.113 | U$4.148 50,50.1 C17.1 | U$4.158 55,50.6 C9.1 | U$4.48 62.5,20.4 C24.1 65.71,17.19 C6.C | C16.1 43.5,50.1 U$4.135 | U$4.14 67.88,39.5 C8.1 | C13.2 16.58,60.9 S2.P | U$4.90 39.5,25 39,24.5 39,24 38.5,23.5
  Bottom 0.254: C21.1 38.7,23.8 39.1,24.2
  other vias: 11.5,60 40,51 49.5,53.5 54,53.5 72.5,42.5 33,45 68.5,21.5 45,39 57.5,16.5 35.5,36 35.5,28 65,52.5 50,16 42,17.5 36,22
  pour Bottom: 0,65 84,65 84,0 0,0
  pour Top: 0,0 84,0 84,65 0,65
ISR_KALMAN
  Bottom 0.2: U$4.133 42.5,48.5 42,49 30.25,49 18.25,37 JP11.1
ISR_UART
  Bottom 0.2: JP12.1 15.71,35.21 30,49.5 42.5,49.5 43,49 U$4.134
JTCK  (via drill 0.6 pad 1.42)  (1 unrouted)
  Bottom 0.2: U$4.137 44.5,49.5 45,50 45,52 44,53 39,53 v37,51 | v7.5,52.5 7.18,52.32 XP1.9
JTDI  (via drill 0.6 pad 1.42)  (1 unrouted)
  Bottom 0.2: U$4.138 45,49.38 45.5,49.88 45.5,52.25 44.25,53.5 37,53.5 v34.5,51 | v7.5,57.5 7.4,57.4 XP1.5
JTDO  (via drill 0.6 pad 1.42)  (1 unrouted)
  Bottom 0.2: U$4.161 56.5,49.5 57.62,50.62 57.62,52.88 v57,53.5 | v7.5,49 5.74,47.24 XP1.13
JTMS  (via drill 0.6 pad 1.42)  (1 unrouted)
  Bottom 0.2: U$4.124 v33,42 | v7.5,55 7.14,54.86 XP1.7
JTRST  (via drill 0.6 pad 1.42)  (1 unrouted)
  Bottom 0.2: U$4.162 57,49 59,51 v59,53.5 | XP1.3 2.31,60 6.5,60 9,62.5 21,62.5 21.5,62 21.5,60.5 22,60 24,60 27,57 58,57 v59,58
LED_G
  Bottom 0.2: R60.2 68,45 67.5,44.5 U$4.4
LED_R
  Bottom 0.2: U$4.3 67.3,45 67.7,45.4 73.5,45.4 R30.2
N$1
  Bottom 0.2: C23.2 38.28,42.5 U$4.125
N$2
  Bottom 0.2: C7.2 44.77,20 46,21.23 U$4.81
N$3
  Bottom 0.2: R43.2 8.09,35.69 JP1.1
N$4
  Bottom 0.2: U$3.22 27.67,2.52 R5.1
N$5
  Bottom 0.2: U$3.20 25.13,2.52 R4.1
N$6
  Bottom 0.2: U$3.18 22.59,2.52 R18.1
N$7
  Bottom 0.2: U$3.16 20.05,2.52 R19.1
N$8
  Bottom 0.2: U$3.40 50.53,2.52 R6.1
N$9
  Bottom 0.2: U$3.38 47.99,2.52 R8.1
N$10
  Bottom 0.2: U$3.64 81.01,2.52 R21.1
N$11
  Bottom 0.2: U$3.36 45.45,2.52 R9.1
N$12
  Bottom 0.2: VD1.A R30.1
N$13
  Bottom 0.2: U$3.62 78.47,2.52 R22.1
N$14
  Bottom 0.2: U$3.34 42.91,2.52 R10.1
N$15
  Bottom 0.2: U$3.32 40.37,2.52 R11.1
N$16
  Bottom 0.2: U$3.30 37.83,2.52 R14.1
N$17
  Bottom 0.2: U$3.28 35.29,2.52 R15.1
N$18
  Bottom 0.2: U$3.26 32.75,2.52 R16.1
N$19
  Bottom 0.2: U$3.24 30.21,2.52 R17.1
N$20
  Bottom 0.2: U$3.14 17.51,2.52 R20.1
N$21
  Bottom 0.2: C12.2 74.31,32.62 ZQ1.3 71.83,32 U$4.29
N$22
  Bottom 0.2: U$4.30 69.28,31.5 ZQ1.1 71.42,28.77 C11.2
N$23
  Bottom 0.2: U$3.12 14.97,2.52 R2.1
N$24
  Bottom 0.2: U$3.10 12.43,2.52 R3.1
N$25
  Bottom 0.2: U$3.60 75.93,2.52 R23.1
N$26
  Bottom 0.2: U$3.58 73.39,2.52 R24.1
N$27
  Bottom 0.2: U$3.56 70.85,2.52 R25.1
N$28
  Bottom 0.2: U$3.54 68.31,2.52 R26.1
N$29
  Bottom 0.2: U$3.52 65.77,2.52 R27.1
N$30
  Bottom 0.2: U$3.50 63.23,2.52 R28.1
N$31
  Bottom 0.2: VD2.A R60.1
N$32
  Bottom 0.2: U$3.48 60.69,2.52 R29.1
N$33
  Bottom 0.2: U$3.46 58.15,2.52 R31.1
N$34
  Bottom 0.2: U$3.44 55.61,2.52 R32.1
N$35
  Bottom 0.2: U$3.42 53.07,2.52 R33.1
N$36
  Bottom 0.2: U$3.8 9.89,2.52 R34.1
N$37
  Bottom 0.2: U$3.6 7.35,2.52 R35.1
N$38
  Bottom 0.2: U$3.4 4.81,2.52 R36.1
N$39
  Bottom 0.2: U$3.2 2.27,2.52 R37.1
N$42
  Bottom 0.2: R42.2 10.63,36.23 JP4.1
N$43
  Bottom 0.2: R41.2 13.17,36.77 JP5.1
N$44
  Bottom 0.2: R40.2 3.01,34.61 JP6.1
N$45
  Bottom 0.2: R39.2 5.55,35.15 JP10.1
NRST  (via drill 0.6 pad 1.42)  (1 unrouted)
  Bottom 0.2: U$4.31 67,31 70.5,27.5 70.5,25 v71,24.5 | XP1.15 2.55,45 6,45 16.21,55.21 S2.S 20,58.94 C13.1 R7.1 25.6,56.5 60.5,56.5 61,57 v63,57
USB_DM
  Bottom 0.2: 7.39,15.88 X1.D- 10.94,15.94 13.5,18.5 15.32,18.5 37.83,41 U$4.122
USB_DP
  Bottom 0.2: U$4.123 37.69,41.5 15.24,19.05 13.34,19.05 11.05,16.76 7.35,16.76 X1.D+
USB_PRESENT
  Bottom 0.2: U$4.121 38,40.5 14.06,16.56 R1.1